# Altium schematic sheet main-board.SchDoc
size A4; DocumentNumber: 1; SheetNumber: 1; SheetTotal: 5
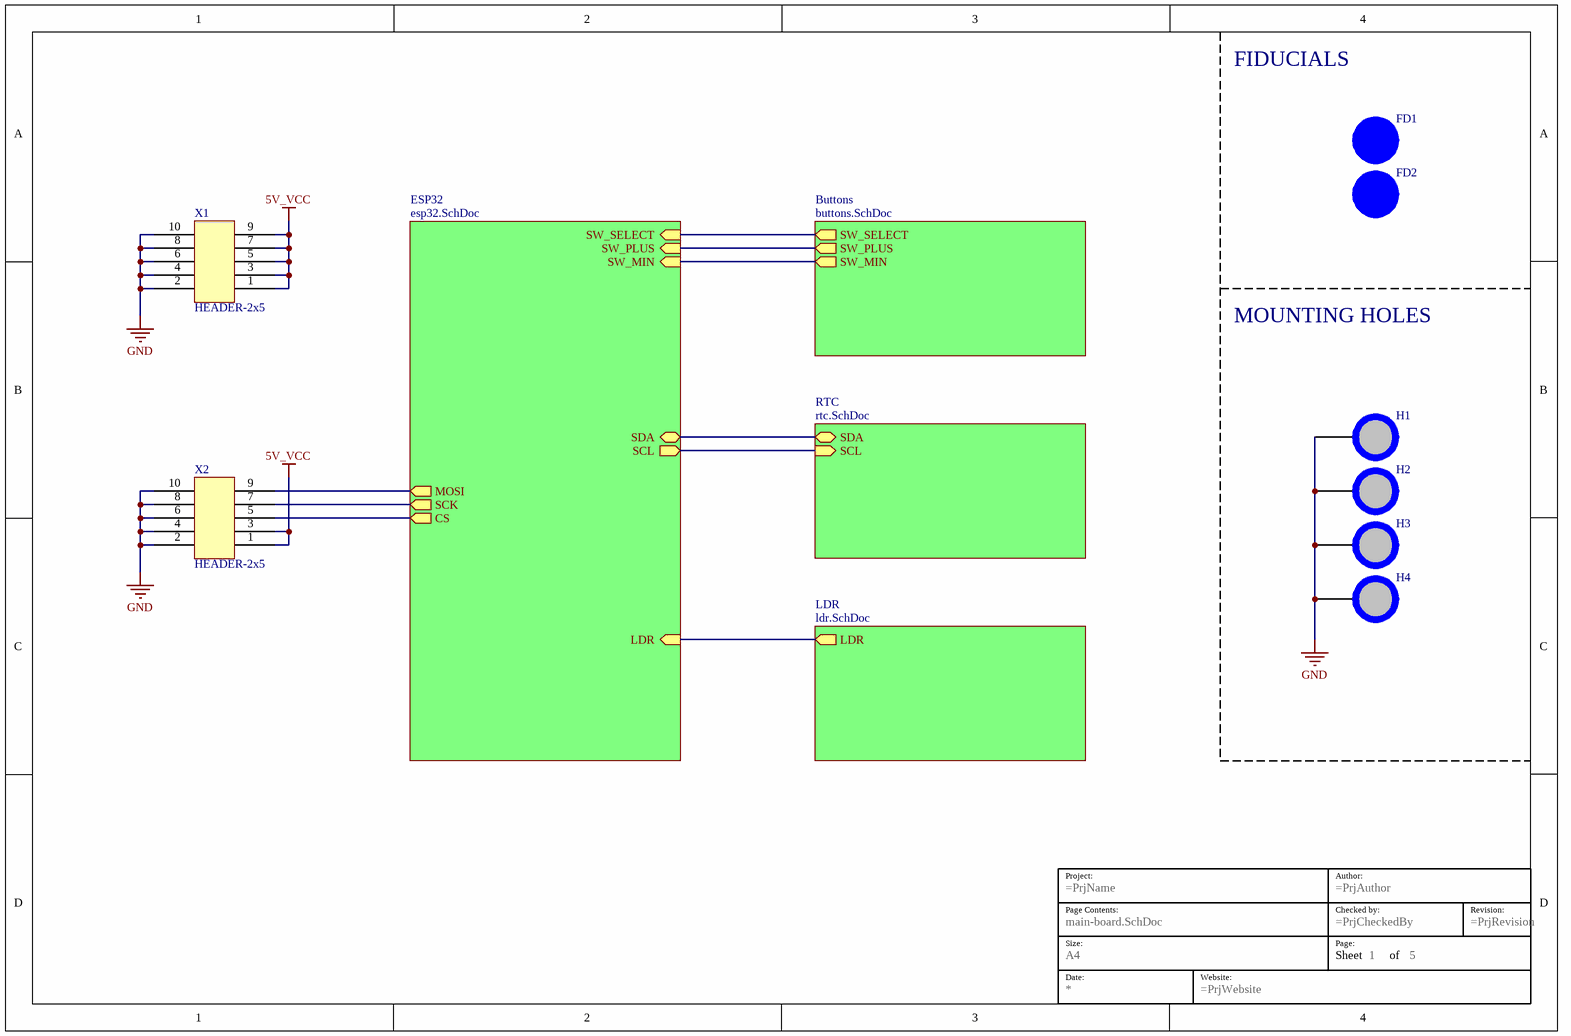
[diagram p0: main-board.SchDoc]

## Parts
*  Size: A4  (hidden comment: TITLE BLOCK)  (graphical)
FD1  FD  [FD]  (value not drawn)
FD2  FD  [FD]  (value not drawn)
H1  SIZE  [HOLE]  (value not drawn)
H2  SIZE  [HOLE]  (value not drawn)
H3  SIZE  [HOLE]  (value not drawn)
H4  SIZE  [HOLE]  (value not drawn)
X1  HEADER-2x5  [HEADER-2x5-FEMALE]
X2  HEADER-2x5  [HEADER-2x5-FEMALE]

## Sub-sheets
Buttons = buttons.SchDoc: SW_SELECT (out), SW_PLUS (out), SW_MIN (out)
ESP32 = esp32.SchDoc: CS (out), SCK (out), MOSI (out), SW_SELECT (in), SW_PLUS (in), SDA (bidir), LDR (in), SCL (out), SW_MIN (in)
LDR = ldr.SchDoc: LDR (out)
RTC = rtc.SchDoc: SDA (bidir), SCL (in)

## Nets
5V_VCC: X1.1 X1.3 X1.5 X1.7 X1.9 X2.1 X2.3
GND: H1.1 H2.1 H3.1 H4.1 X1.2 X1.4 X1.6 X1.8 X1.10 X2.2 X2.4 X2.6 X2.8 X2.10
NetX2_5: X2.5 ; sheet ESP32/CS
NetX2_7: X2.7 ; sheet ESP32/SCK
NetX2_9: X2.9 ; sheet ESP32/MOSI
(unnamed): sheet ESP32/SW_SELECT, sheet Buttons/SW_SELECT
(unnamed): sheet ESP32/SW_PLUS, sheet Buttons/SW_PLUS
(unnamed): sheet ESP32/SDA, sheet RTC/SDA
(unnamed): sheet ESP32/LDR, sheet LDR/LDR
(unnamed): sheet ESP32/SCL, sheet RTC/SCL
(unnamed): sheet ESP32/SW_MIN, sheet Buttons/SW_MIN

Not connected (* = marked no-connect by the designer): FD1 1; FD2 1

## Notes on the sheet
- FIDUCIALS
- MOUNTING HOLES
- (in symbol TITLE BLOCK) Project:; Author:; Page Contents:; Checked by:; Revision:; Size:; Page:; Sheet; of; Date:; Website:

## Library data of the parts
FD1 FD2 = FD: FIDUCIAL MARKER
H1-H4 = MOUNTING-HOLE: M3 MOUNTING HOLE WITH SCREW AND SPACER
X1 X2 = HEADER-2x5: 2.54mm HEADER 2x5; System: Connector